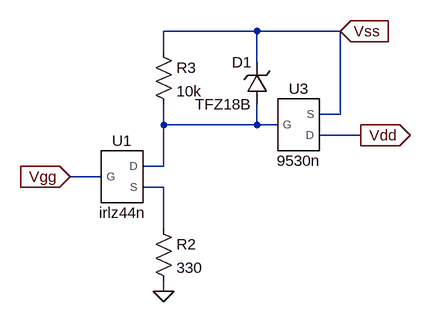
[diagram p0: schematic 9530n_PMOS_HSS_MOSFET.asc]
9530n_PMOS_HSS_MOSFET.asc, the LTspice schematic file:
Version 4
SHEET 1 1160 680
WIRE 64 0 -80 0
WIRE 192 0 64 0
WIRE -80 32 -80 0
WIRE 64 48 64 0
WIRE 192 128 192 0
WIRE 192 128 160 128
WIRE -80 144 -80 112
WIRE 64 144 64 112
WIRE 64 144 -80 144
WIRE 96 144 64 144
WIRE 224 160 160 160
WIRE -80 208 -80 144
WIRE -80 208 -112 208
WIRE -176 224 -224 224
WIRE -80 240 -112 240
WIRE -80 304 -80 240
WIRE -80 400 -80 384
FLAG 192 0 Vss
IOPIN 192 0 In
FLAG -224 224 Vgg
IOPIN -224 224 In
FLAG 224 160 Vdd
IOPIN 224 160 Out
FLAG -80 400 0
SYMBOL AutoGenerated\\9530n 128 144 R0
SYMATTR InstName U3
SYMBOL res -96 16 R0
SYMATTR InstName R3
SYMATTR Value 10k
SYMBOL zener 80 112 R180
WINDOW 0 24 64 Left 2
WINDOW 3 24 0 Left 2
SYMATTR InstName D1
SYMATTR Value TFZ18B
SYMBOL res -96 288 R0
SYMATTR InstName R2
SYMATTR Value 330
SYMBOL AutoGenerated\\irlz44n -144 224 R0
SYMATTR InstName U1

The netlist it stands for:
* 9530n_PMOS_HSS_MOSFET.asc
XU3 Vdd N001 Vss 9530n  ; pins D G S
R3 Vss N001 10k
D1 N001 Vss TFZ18B
R2 N002 0 330
XU1 N001 Vgg N002 irlz44n  ; pins D G S
.model D D
.lib standard.dio
.lib 9530n.spi
.lib Z:\home\brian\Downloads\irlz44n.spi
.backanno
.end